# EAGLE design inverter (EAGLE 6.1)
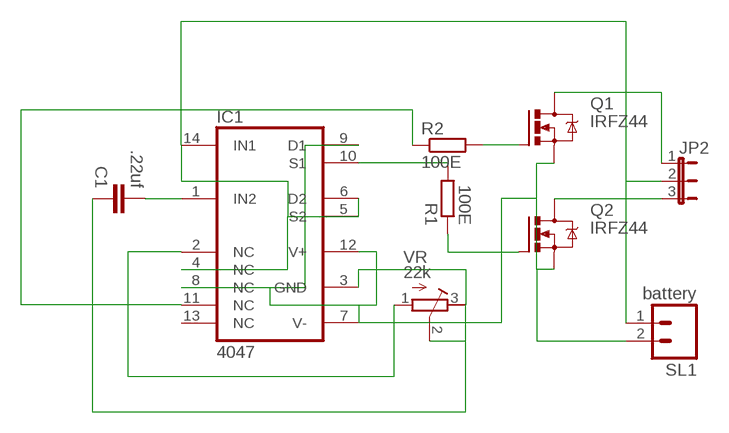
[diagram p0: schematic, sheet 1]

## Parts
C1  .22uf  C5/3.5  [C5B3.5]
IC1  4047  DG200ACJ  [DIL14]
JP2  JP2E  [JP2]
Q1  IRFZ44  IRFZ48Z  [TO220BH]
Q2  IRFZ44  IRFZ48Z  [TO220BH]
R1  100E  R-EU_0207/15  [0207/15]
R2  100E  R-EU_0207/15  [0207/15]
SL1  battery  M02  [02P]
VR  22k  R-TRIMM64P  [RTRIM64P]

## Nets
N$1: IC1.11(NC) R2.1
N$2: Q2.G R1.1
N$3: IC1.10(S1) R1.2
N$4: Q1.G R2.2
N$5: IC1.7(V-) IC1.8(NC) IC1.9(D1) IC1.12(V+) Q1.S Q2.S SL1.2
N$6: JP2.1 Q1.D
N$7: JP2.3 Q2.D
N$8: IC1.4(NC) IC1.5(S2) IC1.6(D2) IC1.14(IN1) JP2.2 SL1.1
N$10: C1.2 IC1.1(IN2)
N$11: IC1.2(NC) VR.1(E)
N$12: C1.1 IC1.3(GND) VR.2(S) VR.3(A)
Unconnected: IC1.13(NC)

## Library data of the parts
C1 = capacitor-wima:C: CAPACITOR naming: grid - package width
IC1 = maxim:DG200ACJ: ANALOG SWITCH; OC_FARNELL: unknown; OC_NEWARK: 77C6395
JP2 = jumper:JP2E: JUMPER
Q1 Q2 = transistor-power:IRFZ48: N Channel HEXFET® Power MOSFET Logic Level Source: http://www.irf.com/product-info/datasheets/data/irfz48z.pdf
R1 R2 = rcl:R-EU_: RESISTOR, European symbol
SL1 = con-amp-quick:M02: AMP QUICK CONNECTOR; OC_FARNELL: unknown; OC_NEWARK: unknown
VR = resistor:R-TRIMM: Trimm resistor

## Board
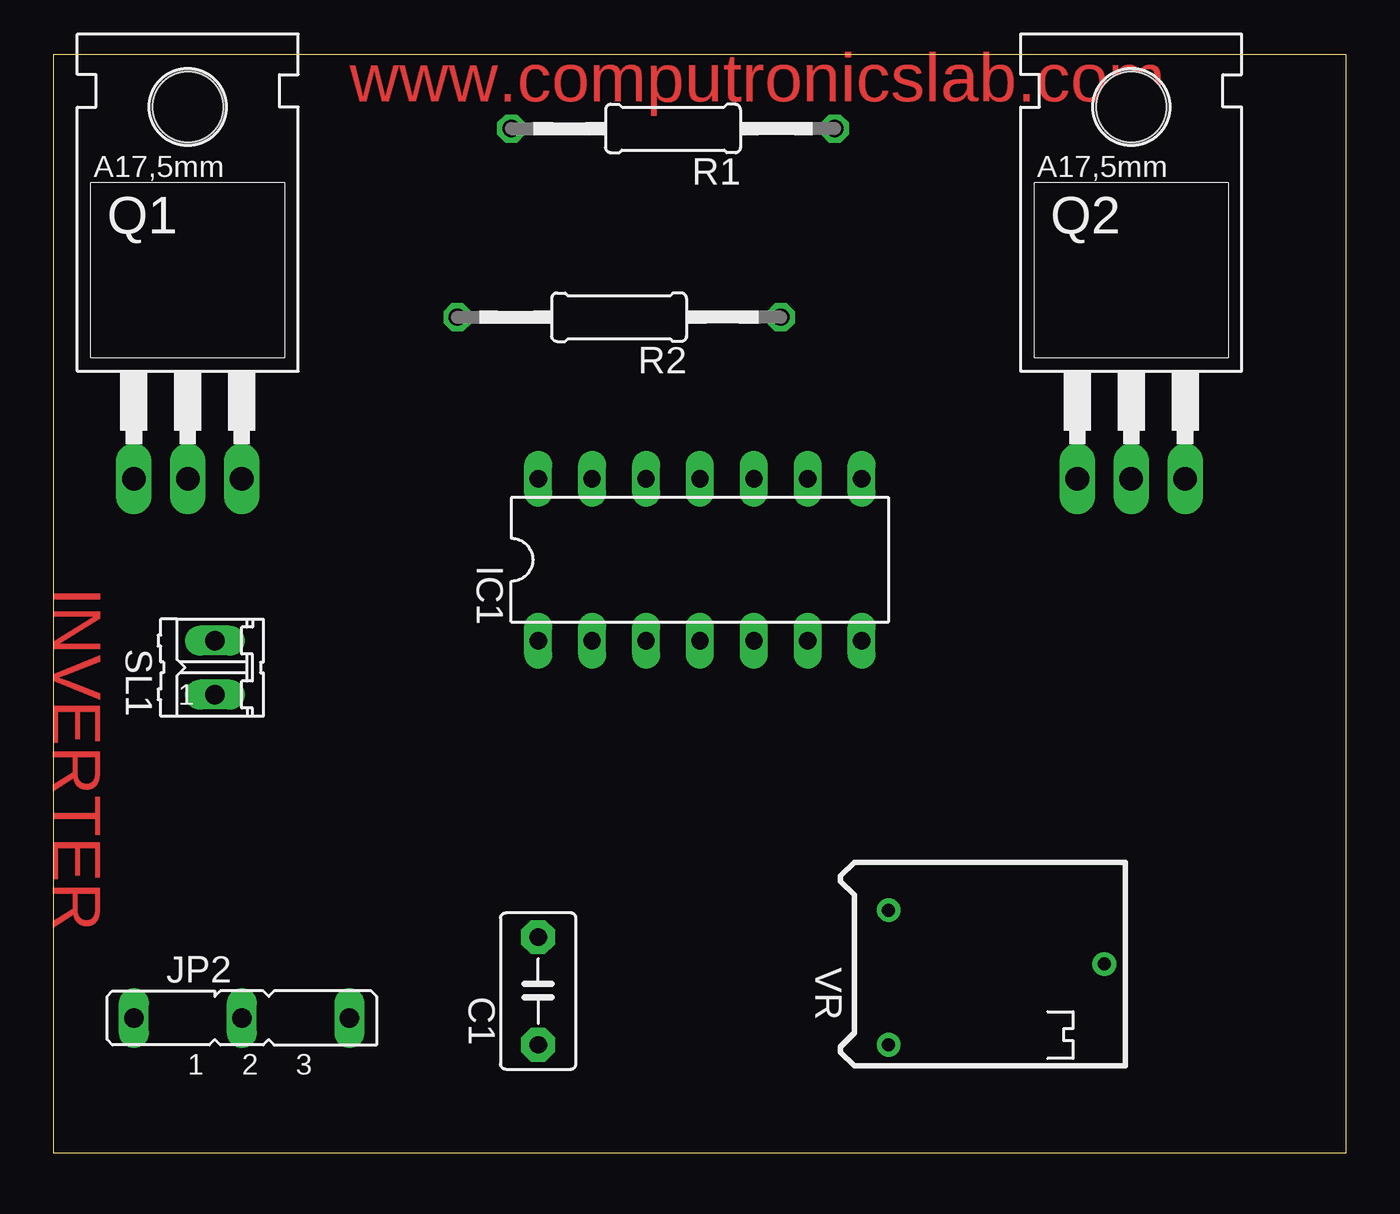
[diagram p1: board, top side]
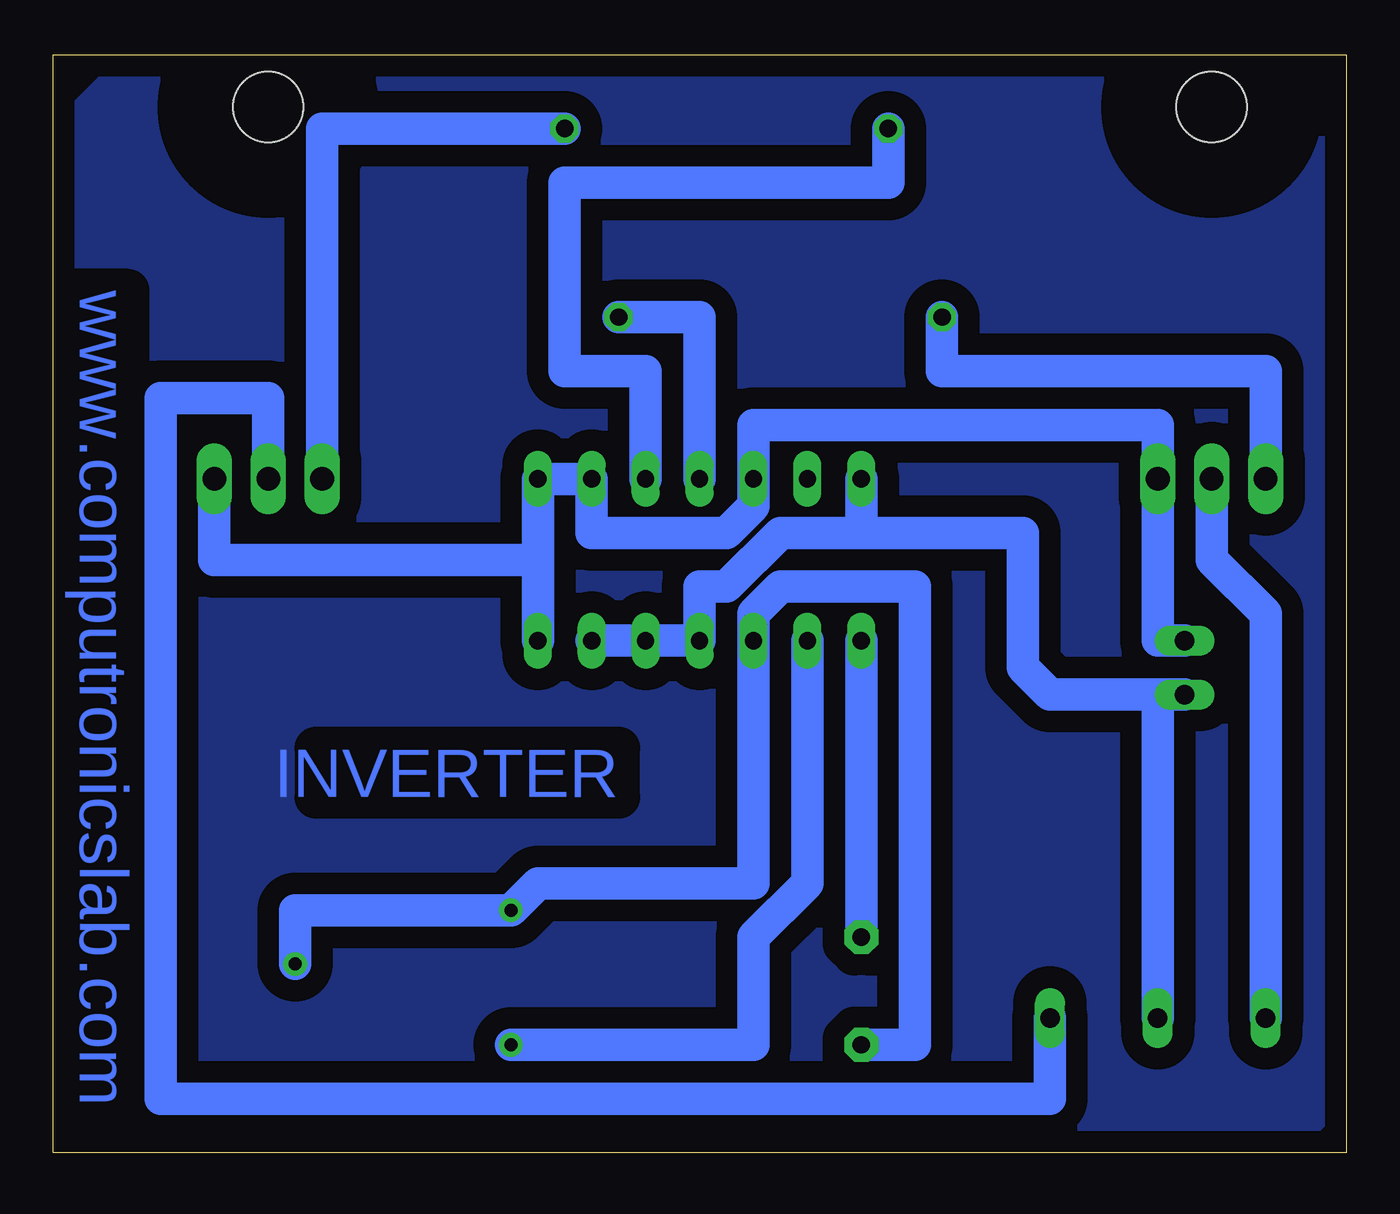
[diagram p2: board, bottom side, seen from below]

Size 60.94 x 51.74 mm. Coordinates in mm from the lower left corner, seen from the top.
Outline: 0,0 60.94,0 60.94,51.74 0,51.74 0,0
Copper layers (1*16): Top 0.035mm / dielectric 1.5mm / Bottom 0.035mm
Design rules: minimum track width 60mil, minimum drill 24mil, track to track 8mil, track to pad 8mil, pad to pad 8mil, via to via 8mil, smd to smd 8mil, copper to edge 40mil, drill to drill 8mil, minimum pad ring 10mil, minimum via ring 8mil, stop-mask expansion 4mil, vias tented up to drill 0mil, thermal gap 10mil

### Footprints (pad centres in the part's own frame; a part is rotated, then mirrored left to right if it is on the bottom)
C5B3.5 = drill 0.813 pad 1.6 octagon: 1 -2.54,0; 2 2.54,0
DIL14 = drill 0.813 long: 1 -7.62,-3.81; 2 -5.08,-3.81; 3 -2.54,-3.81; 4 0,-3.81; 5 2.54,-3.81; 6 5.08,-3.81; 7 7.62,-3.81; 8 7.62,3.81; 9 5.08,3.81; 10 2.54,3.81; 11 0,3.81; 12 -2.54,3.81; 13 -5.08,3.81; 14 -7.62,3.81
JP2 = drill 0.914 long: 1 -5.08,0; 2 0,0; 3 5.08,0
TO220BH = drill 1.118 long: D 0,-6.35; G -2.54,-6.35; S 2.54,-6.35 | hole 3.302: 0,11.176
0207/15 = drill 0.813 octagon: 1 -7.62,0; 2 7.62,0
02P = drill 0.914 long: 1 -1.27,0; 2 1.27,0
RTRIM64P = drill 0.61: 1 -2.54,-3.81; 2 7.62,0; 3 -2.54,2.54

### Placement (x,y rotation side)
C1  22.86,7.62 90 top
IC1  30.48,27.94 0 top
JP2  8.89,6.35 0 top
Q1  6.35,38.1 0 top
Q2  50.8,38.1 0 top
R1  29.21,48.26 180 top
R2  26.67,39.37 180 top
SL1  7.62,22.86 90 top
VR  41.91,8.89 0 top

### Tracks (layer width: path | path; a pad name or v marks a point on that pad's centre or on a via)
N$1
  Bottom 1.524: IC1.11 30.48,39.37 R2.1
N$2
  Bottom 1.524: R1.1 48.26,48.26 Q2.G
N$3
  Bottom 1.524: IC1.10 33.02,36.83 34.29,36.83 36.83,36.83 36.83,39.37 36.83,45.72 21.59,45.72 R1.2
N$4
  Bottom 1.524: R2.2 19.05,36.83 3.81,36.83 3.81,33.02 Q1.G
N$5
  Bottom 1.524: 38.1,27.94 IC1.8 IC1.9 35.56,29.21 29.21,29.21 27.94,30.48 IC1.12 27.94,34.29 17.78,34.29 | 38.1,27.94 IC1.7 | Q2.S 53.34,27.94 38.1,27.94 | 8.89,34.29 17.78,34.29 | Q1.S 8.89,34.29 | 17.78,34.29 8.89,34.29 | 8.89,34.29 8.89,24.13 SL1.2
N$6
  Bottom 1.524: JP2.1 3.81,25.4 6.35,27.94 6.35,30.48 Q1.D
N$7
  Bottom 1.524: JP2.3 13.97,2.54 45.72,2.54 55.88,2.54 55.88,12.7 55.88,35.56 53.34,35.56 50.8,35.56 50.8,33.02 Q2.D
N$8
  Bottom 1.524: IC1.6 IC1.5 IC1.4 30.48,26.67 29.21,26.67 26.67,29.21 22.86,29.21 | 22.86,29.21 15.24,29.21 15.24,22.86 13.97,21.59 12.7,21.59 8.89,21.59 | 22.86,29.21 IC1.14 | 8.89,21.59 SL1.1 8.89,21.59 | 8.89,21.59 JP2.2
N$9
  pour Bottom (isolate 1.016): 3.81,0 2.54,0 0,2.54 0,49.53 2.54,52.07 57.15,52.07 60.96,48.26 60.96,2.54 58.42,0
N$10
  Bottom 1.524: C1.2 IC1.1
N$11
  Bottom 1.524: VR.1 27.94,5.08 27.94,10.16 25.4,12.7 IC1.2
N$12
  Bottom 1.524: VR.2 49.53,11.43 VR.3 38.1,12.7 27.94,12.7 IC1.3 27.94,25.4 26.67,26.67 20.32,26.67 20.32,5.08 C1.1

### Text on the board
Top: www.computronicslab.com | INVERTER
Bottom: www.computronicslab.com | INVERTER